# EAGLE design BabyPad (EAGLE 9.2.0)
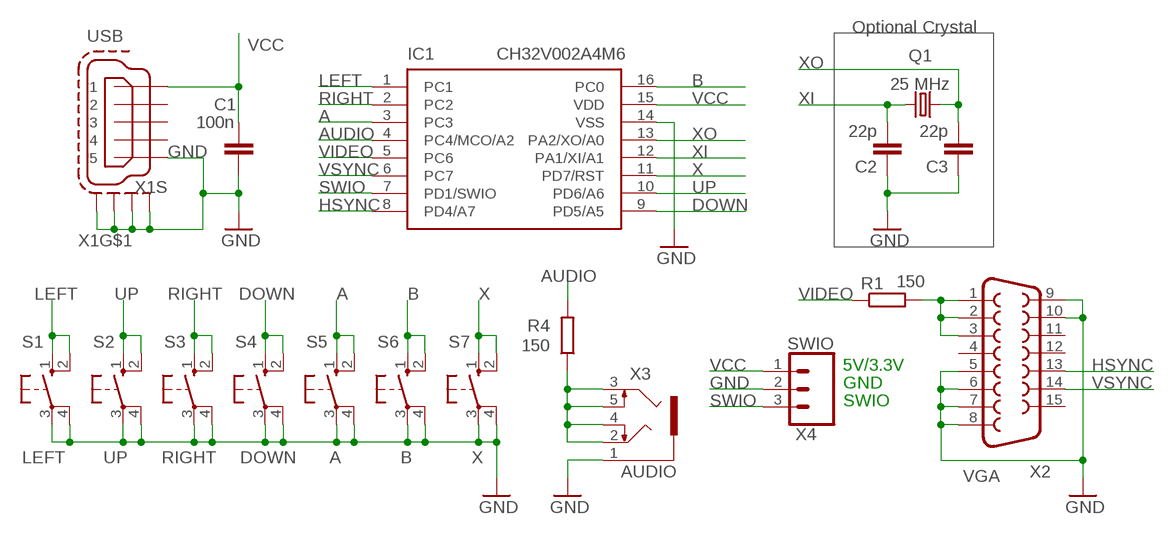
[diagram p0: schematic, sheet 1]

## Parts
C1  100n  C-EU050-024X044  [C050-024X044]
C2  22p  C-EU050-024X044  [C050-024X044]
C3  22p  C-EU050-024X044  [C050-024X044]
IC1  CH32V002A4M6  [SOP16]
Q1  25 MHz  CRYSTALHC49U-V  [HC49U-V]
R1  150  R-EU_0204/7  [0204/7]
R4  150  R-EU_0204/7  [0204/7]
S1  LEFT  10-XX  [B3F-10XX]
S2  UP  10-XX  [B3F-10XX]
S3  RIGHT  10-XX  [B3F-10XX]
S4  DOWN  10-XX  [B3F-10XX]
S5  A  10-XX  [B3F-10XX]
S6  B  10-XX  [B3F-10XX]
S7  X  10-XX  [B3F-10XX]
X1  USB  MINI-USB-SCHIELD-32005-201  [32005-201]
X2  VGA  F15HDH  [HDF15H]
X3  AUDIO  1503_09  [1503_09]
X4  SWIO  CONN_03LONGPADS  [1X03_LONGPADS]

## Nets
A: IC1.3(PC3) S5.1(S) S5.2(S1)
AUDIO: IC1.4(PC4/MCO/A2) R4.2
B: IC1.16(PC0) S6.1(S) S6.2(S1)
DOWN: IC1.9(PD5/A5) S4.1(S) S4.2(S1)
GND: C1.2 C2.1 C3.1 IC1.14(VSS) S1.3(P) S1.4(P1) S2.3(P) S2.4(P1) S3.3(P) S3.4(P1) S4.3(P) S4.4(P1) S5.3(P) S5.4(P1) S6.3(P) S6.4(P1) S7.3(P) S7.4(P1) X1.5 X1.M1(S:S1) X1.M2(S:S2) X1.M3(S:S3) X1.M4(S:S4) X2.5 X2.6 X2.7 X2.8 X2.9 X2.10 X3.1 X4.2
HSYNC: IC1.8(PD4/A7) X2.13
LEFT: IC1.1(PC1) S1.1(S) S1.2(S1)
N$1: R1.2 X2.1 X2.2 X2.3
N$7: R4.1 X3.2 X3.3 X3.4 X3.5
RIGHT: IC1.2(PC2) S3.1(S) S3.2(S1)
SWIO: IC1.7(PD1/SWIO) X4.3
UP: IC1.10(PD6/A6) S2.1(S) S2.2(S1)
VCC: C1.1 IC1.15(VDD) X1.1 X4.1
VIDEO: IC1.5(PC6) R1.1
VSYNC: IC1.6(PC7) X2.14
X: IC1.11(PD7/RST) S7.1(S) S7.2(S1)
XI: C2.2 IC1.12(PA1/XI/A1) Q1.2
XO: C3.2 IC1.13(PA2/XO/A0) Q1.1
Unconnected: X1.2 X1.3 X1.4 X2.4 X2.11 X2.12 X2.15

## Notes on the sheet
- Optional Crystal
- 5V/3.3V
- GND
- SWIO

## Library data of the parts
C1-C3 = rcl:C-EU: CAPACITOR, European symbol; SPICEPREFIX: C
IC1 = CH32V:CH32V002A4M6
Q1 = crystal:CRYSTAL: CRYSTAL; OC_FARNELL: 1666969; OC_NEWARK: unknown
R1 R4 = rcl:R-EU_: RESISTOR, European symbol; SPICEPREFIX: R
S1-S7 = switch-omron:10-XX: OMRON SWITCH; MPN: B3F-1000; OC_FARNELL: 176432; OC_NEWARK: 36M3542
X1 = con-cypressindustries:MINI-USB-SCHIELD-: MINI USB-B Conector Source: www.cypressindustries.com; OC_FARNELL: unknown; OC_NEWARK: unknown
X2 = adafruit_B:F15: SUB-D HDH is also known as a 'right angle VGA' connector
X3 = con-lumberg:1503_09: Jack connectors according to JISC 6560, 3.5 mm Klinkeneinbaukupplung nach JISC 6560, 3,5 mm, 3-polig/ stereo, abgewinkelte Ausführung, mit 2 Öffnern und Lötaugen, für Leiterplatten Rückseitenmontage Source: http://www.lumberg.com/Produkte/PDFs/1503_09.pdf; OC_FARNELL: 1243244; OC_NEWARK: unknown
X4 = SparkFun-Connectors:CONN_03: Multi connection point. Often used as Generic Header-pin footprint for 0.1 inch spaced/style header connections On any of the 0.1 inch spaced packages, you can populate with these: Break Away Headers - Straight <https://www.sparkfun.com/products/116> (PRT-00116) Break Away Male Headers - Right Angle <https://www.sparkfun.com/products/553> (PRT-00553) Female Headers <https://www.sparkfun.com/products/115> (PRT-00115) Break Away Headers - Machine Pin <https://www.sparkfun.com/products/117> (PRT-00117) Break Away Female Headers - Swiss Machine Pin <https://www.sparkfun.com/products/743> (PRT-00743) Stackable Header - 3 Pin (Female, 0.1") <https://www.sparkfun.com/products/13875> (PRT-13875) For SCREWTERMINALS and SPRING TERMINALS visit here: Screw Terimnals on SparkFun.com <https://www.sparkfun.com/search/results?term=Screw+Terminals> (5mm/3.5mm/2.54mm spacing) This device is also useful as a general connection point to wire up your design to another part of your project. Our various solder wires solder well into these plated through hole pads. Hook-Up Wire - Assortment (Stranded, 22 AWG) <https://www.sparkfun.com/products/11375> (PRT-11375) Hook-Up Wire - Assortment (Solid Core, 22 AWG) <https://www.sparkfun.com/products/11367> (PRT-11367) View the entire wire category on our website here <https://www.sparkfun.com/categories/141> Special notes: Molex polarized connector foot print use with SKU : PRT-08232 with associated crimp pins and housings.

## Board
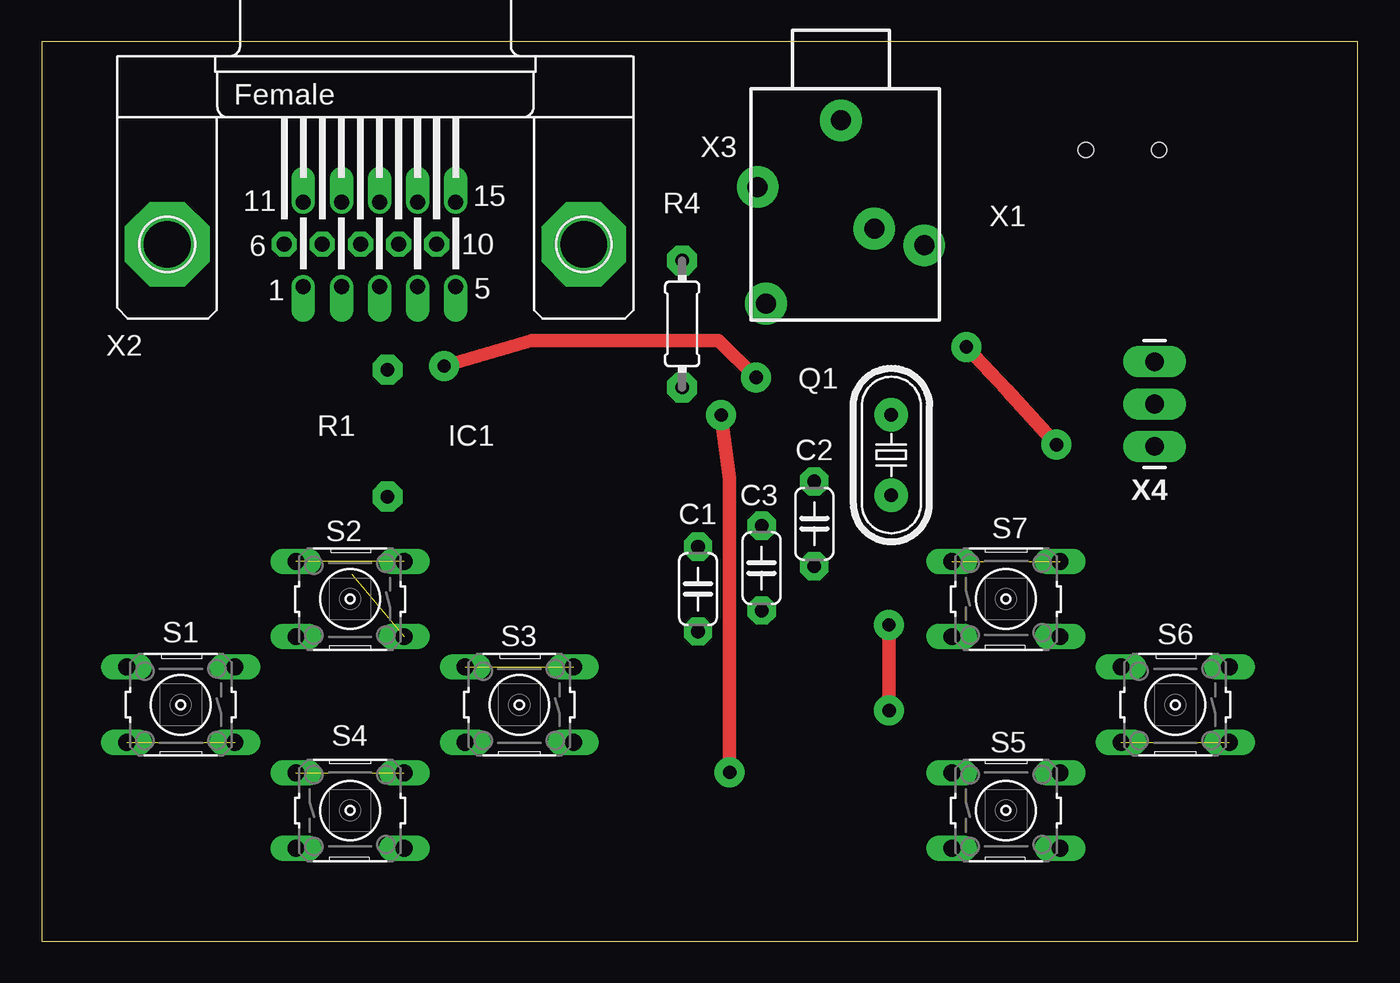
[diagram p1: board, top side]
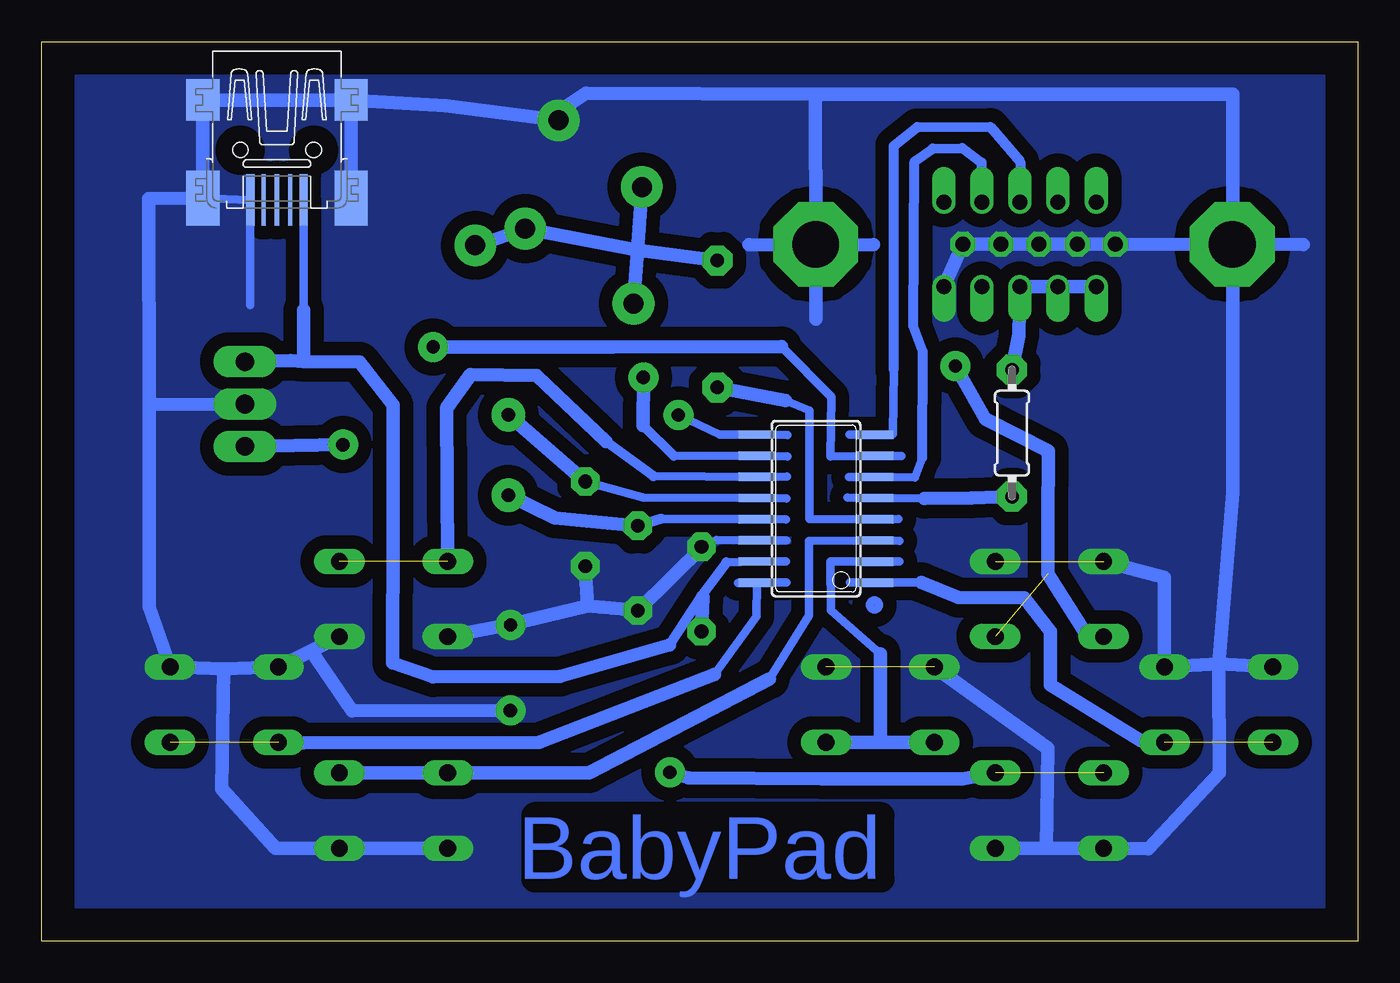
[diagram p2: board, bottom side, seen from below]

Size 79 x 54 mm. Coordinates in mm from the lower left corner, seen from the top.
Outline: 0,0 79,0 79,54 0,54 0,0
Copper layers (1*16): Top 0.035mm / dielectric 1.5mm / Bottom 0.035mm
Design rules "default": minimum track width 6mil, minimum drill 0.35mm, track to track 6mil, track to pad 6mil, pad to pad 6mil, via to via 6mil, smd to smd 6mil, copper to edge 40mil, drill to drill 6mil, minimum pad ring 10mil, minimum via ring 8mil, stop-mask expansion 4mil, vias tented up to drill 0mil, thermal gap 10mil

### Footprints (pad centres in the part's own frame; a part is rotated, then mirrored left to right if it is on the bottom)
C050-024X044 = drill 0.813 pad 1.7 octagon: 1 -2.54,0; 2 2.54,0
SOP16 = smd 0.5 x 2.2: 1 -4.445,-3.55; 2 -3.185,-3.55; 3 -1.915,-3.55; 4 -0.645,-3.55; 5 0.635,-3.55; 6 1.895,-3.55; 7 3.165,-3.55; 8 4.435,-3.55; 9 4.445,3.55; 10 3.175,3.55; 11 1.905,3.55; 12 0.635,3.55; 13 -0.635,3.55; 14 -1.905,3.55; 15 -3.175,3.55; 16 -4.445,3.55
HC49U-V = drill 0.813 pad 2: 1 -2.413,0; 2 2.413,0
0204/7 = drill 0.813 pad 1.8 octagon: 1 -3.81,0; 2 3.81,0
B3F-10XX = drill 1.016 long: 1 -3.251,2.261; 2 3.251,2.261; 3 -3.251,-2.261; 4 3.251,-2.261
32005-201 = smd 3.1 x 0.5: 1 3,1.6; 5 3,-1.6 | smd 3.1 x 0.254: 2 3,0.8; 3 3,0; 4 3,-0.8 | smd 2.5 x 2: M1 -3,-4.45; M2 -3,4.45 | smd 3.3 x 2: M3 2.9,4.45; M4 2.9,-4.45 | hole 0.9: 0,2.2; 0,-2.2
HDF15H = drill 0.9 pad 1.27 offset: 1 4.329,2.54; 2 2.043,2.54; 3 -0.243,2.54; 4 -2.529,2.54; 5 -4.815,2.54; 11 4.329,-2.54; 12 2.043,-2.54; 13 -0.243,-2.54; 14 -2.529,-2.54; 15 -4.815,-2.54 | drill 0.9 pad 1.5 octagon: 6 5.472,0; 7 3.186,0; 8 0.9,0; 9 -1.386,0; 10 -3.672,0 | drill 2.8 pad 5.08 octagon: P$1 -12.5,0; P$2 12.5,0
1503_09 = drill 1.2 pad 2.5: 1 0,-2; 2 -5,-6; 3 5,-9.5; 4 -4.5,-13; 5 2,-8.5
1X03_LONGPADS = drill 1.118 pad 1.88 long: 1 0,0; 2 2.54,0; 3 5.08,0

### Placement (x,y rotation side)
C1  39.39,21.13 90 top
C2  46.38,25.06 90 top
C3  43.21,22.39 90 top
IC1  32.52,25.97 90 bottom
Q1  51,29.19 90 top
R1  20.76,30.5 90 bottom
R4  38.44,37.05 270 top
S1  8.35,14.19 180 top
S2  18.51,20.54 180 top
S3  28.67,14.19 180 top
S4  18.51,7.84 0 top
S5  57.88,7.84 0 top
S6  68.04,14.19 180 top
S7  57.88,20.54 0 top
X1  64.88,47.49 270 bottom
X2  20.04,41.83 180 top
X3  47.97,51.28 0 top
X4  66.8,34.79 270 top

### Tracks (layer width: path | path; a pad name or v marks a point on that pad's centre or on a via)
A
  Bottom 0.508: 35.3,15.74 32.93,19.57 32.93,24.04 IC1.3 27.52,24.01
  Bottom 0.813: 35.3,15.74 46.16,10.1 S5.1 S5.2
AUDIO
  Bottom 0.508: 34.37,32.46 32.9,31.85 32.9,25.33 IC1.4 27.59,25.34
  Bottom 0.813: 34.37,32.46 R4.2
B  (1 unrouted)
  Bottom 0.508: IC1.16 36.11,19.51 38.61,16.02 | IC1.16 34.28,21.52 | IC1.16 37.19,21.49
  Bottom 0.61: 63.3,11.89 S6.2
  Bottom 0.813: 38.61,16.02 49.15,11.93 63.3,11.89
DOWN  (via drill 0.8 pad 1.8)  (1 unrouted)
  Top 0.813: v40.78,31.59 41.29,27.78 v41.3,10.13
  Bottom 0.508: v40.78,31.59 38.3,30.41 IC1.9 34.22,30.38
  Bottom 0.813: v41.3,10.13 40.19,9.81 32.17,9.75 23.7,9.75 S4.2
GND  (via drill 0.8 pad 1.8)  (2 unrouted)
  Top 0.813: v50.87,13.85 v50.86,18.99
  Bottom 0.508: 39.23,23.78 38.48,24.07 IC1.14 34.28,24.04 | 66.48,38.19 X1.5 X1.M4 | v50.86,18.99 50.87,19.01
  Bottom 0.61: 7.49,41.83 7.5,41.85 | 48.02,49.8 X3.1 | C1.2 39.23,23.78
  Bottom 0.813: X2.5 X2.10 X2.9 X2.8 X2.7 X2.6 7.49,41.83 7.5,26.93 8.34,16.65 | 3.27,41.82 7.5,41.85 7.5,50.85 32.56,50.86 | 39.23,23.78 C3.1 46.22,20.12 | S2.4 11.6,21.83 S1.3 8.34,16.65 | 8.34,16.65 S1.4 | 18.7,5.58 S4.3 12.58,5.55 8.33,10.12 8.34,16.65 | 18.7,5.58 S4.4 | S3.4 18.6,11.59 18.7,5.58 | S5.3 S5.4 64.96,5.57 68.18,9.15 68.06,16.34 | 68.06,16.34 S6.3 72.53,20.06 72.54,32.23 | 68.06,16.34 S6.4 62.83,17.43 | 46.22,20.12 50.87,19.01 S7.3 | S7.4 62.83,17.43 | X4.2 72.54,32.23 | 72.54,32.23 72.58,44.57 X1.M4 X1.M1 X1.M2 | X3.1 54.74,50.16 X1.M2 | X1.M2 X1.M3 | 32.56,50.86 46.31,50.89 48.02,49.8 | 32.56,50.86 32.53,41.75 | 32.53,41.75 32.53,37.35 | 32.53,41.75 29.09,41.81 | 32.53,41.75 36.53,41.81 | C2.1 46.22,20.12 | 62.83,17.43 60.36,13.82 v50.87,13.85
  pour Bottom (isolate 0.813, no thermals): 2,2 2,52 77,52 77,2
HSYNC
  Bottom 0.508: 27.86,34.31 27.91,30.44 IC1.8 30.53,30.41
  Bottom 0.61: 27.86,34.31 27.86,36.75 27.85,47.75 26.46,48.87 22.06,48.88 20.27,46.78 X2.13
LEFT  (1 unrouted)
  Bottom 0.508: 26.2,21.54 IC1.1 30.5,21.52
  Bottom 0.61: 13.05,12.06 11.81,12
  Bottom 0.813: 26.2,21.54 23.98,20.62 20,20.6 18.45,18.59 18.46,15.39 13.05,12.06 | 11.81,12 S1.1
N$1
  Bottom 0.813: X2.1 X2.2 X2.3 20.35,36.39 R1.2
N$7
  Bottom 0.61: 52.41,41.9 X3.3
  Bottom 0.813: X3.4 43.24,41.49 | 43.24,41.49 X3.2 | 52.41,41.9 X3.5 43.24,41.49 | R4.1 43.24,41.49
RIGHT
  Bottom 0.508: 28.65,17.26 31.63,19.86 31.65,22.79 IC1.2 27.52,22.78
  Bottom 0.813: 28.65,17.26 28.64,11.94 | 28.64,11.94 S3.1 | S3.2 28.64,11.94
SWIO  (via drill 0.8 pad 1.8)
  Top 0.813: v55.51,35.67 57.9,33.13 v60.91,29.81
  Bottom 0.508: 34.58,35.68 31.61,32.66 31.65,29.09 IC1.7 27.41,29.12
  Bottom 0.813: 34.58,35.68 44.69,35.67 v55.51,35.67 | v60.91,29.81 X4.3
UP  (via drill 0.8 pad 1.8)  (1 unrouted)
  Top 0.813: v42.88,33.84 40.64,36.05 29.42,36.05 v24.16,34.53
  Bottom 0.508: 41.05,29.14 IC1.10 34.22,29.09
  Bottom 0.61: 41.05,29.14 42.91,30.95
  Bottom 0.813: 42.91,30.95 v42.88,33.84 | v24.16,34.53 22.36,31.34 18.58,29.42 18.61,25.12 18.61,22.03 16.26,18.37 S2.2
VCC
  Bottom 0.508: 37.91,22.75 IC1.15 34.31,22.78 | X1.1 63.28,37.89
  Bottom 0.61: 37.91,22.75 39.4,20.73 | 39.4,20.73 41.32,17.79 | 39.32,20.66 39.4,20.73
  Bottom 0.813: 41.32,17.79 47.88,15.9 55.49,15.87 57.93,16.7 57.9,25.03 57.91,32.18 59.92,34.76 63.29,34.8 | X4.1 64.05,34.87 63.29,34.8 | 63.28,37.89 63.29,34.8 | C1.1 39.32,20.66
VIDEO
  Bottom 0.508: 26.02,26.57 IC1.5 30.65,26.63
  Bottom 0.813: 26.02,26.57 23.19,26.59 R1.1
VSYNC
  Bottom 0.508: 26.14,29.03 26.59,27.84 IC1.6 30.56,27.86
  Bottom 0.61: 26.14,29.03 26.11,35.4 26.68,36.93 26.61,46.8 25.51,47.59 23.74,47.62 22.59,46.74 X2.14
X  (1 unrouted)
  Bottom 0.508: 42.28,27.91 IC1.11 34.25,27.89
  Bottom 0.61: 42.28,27.91 45.13,30.01
  Bottom 0.813: 45.13,30.01 49.3,33.96 53.25,34.01 54.7,32 S7.1
XI
  Bottom 0.508: C2.2 42.9,26.63 IC1.12 34.28,26.57
  Bottom 0.813: C2.2 Q1.2
XO
  Bottom 0.508: 41.82,25.35 IC1.13 34.31,25.3
  Bottom 0.61: 41.82,25.35 C3.2
  Bottom 0.813: C3.2 48.18,25.39 Q1.1
(copper drawn outside any net)
  shapes: Bottom circle x1

### Text on the board
Bottom: BabyPad
Document: +5V | GND | SWIO